# Altium schematic sheet Uart_Can.SchDoc
size A4
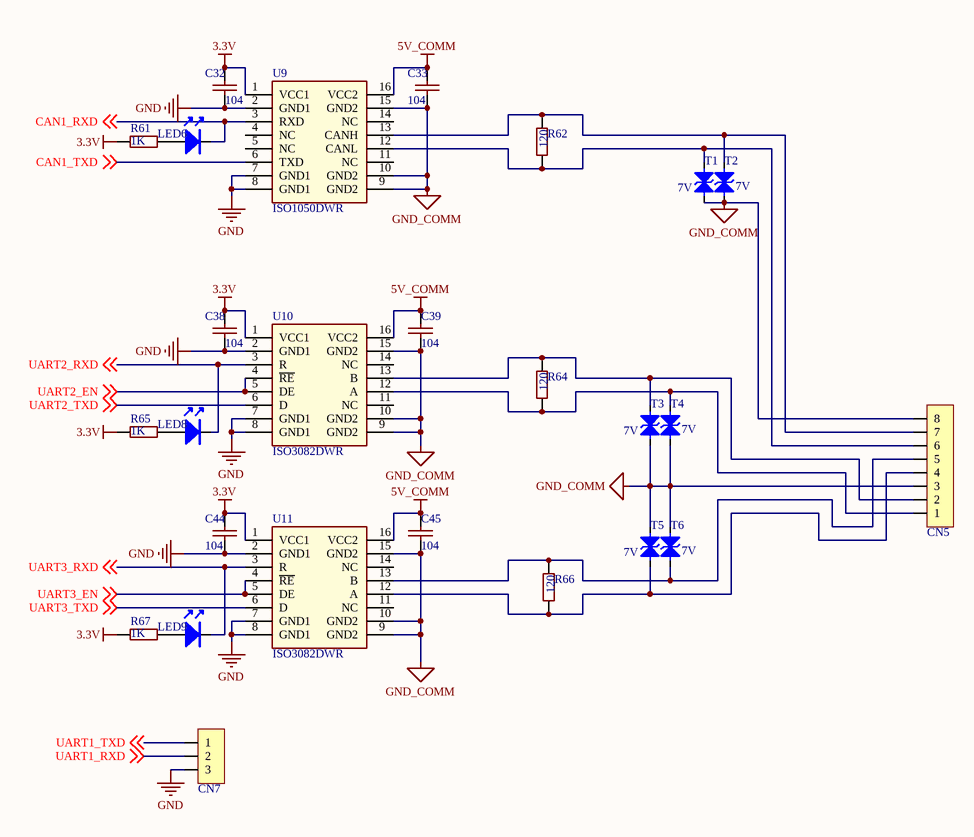
[diagram p0: Uart_Can.SchDoc]

## Parts
C32  104  [0805SMD_Cap]
C33  104  [0805SMD_Cap]
C38  104  [0805SMD_Cap]
C39  104  [0805SMD_Cap]
C44  104  [0805SMD_Cap]
C45  104  [0805SMD_Cap]
CN5  CON8  [WJ15EDGRM-3.81-8P]  (value not drawn)
CN7  CON3  [DIP3]  (value not drawn)
LED6  LED  [发光二极管0805]  (value not drawn)
LED8  LED  [发光二极管0805]  (value not drawn)
LED9  LED  [发光二极管0805]  (value not drawn)
R61  1K  [0805_SMD_R]
R62  120  [0805_SMD_R]
R64  120  [0805_SMD_R]
R65  1K  [0805_SMD_R]
R66  120  [0805_SMD_R]
R67  1K  [0805_SMD_R]
T1  7V  [二极管SMA]
T2  7V  [二极管SMA]
T3  7V  [二极管SMA]
T4  7V  [二极管SMA]
T5  7V  [二极管SMA]
T6  7V  [二极管SMA]
U9  ISO1050DWR  [SOIC_16]
U10  ISO3082DWR  [SOIC_16]
U11  ISO3082DWR  [SOIC_16]

## Nets
3.3V: C32.2 C38.2 C44.2 R61.2 R65.2 R67.2 U9.1(VCC1) U10.1(VCC1) U11.1(VCC1)
5V_COMM: C33.2 C39.2 C45.2 U9.16(VCC2) U10.16(VCC2) U11.16(VCC2)
GND: C32.1 C38.1 C44.1 CN7.3 U9.2(GND1) U9.7(GND1) U9.8(GND1) U10.2(GND1) U10.7(GND1) U10.8(GND1) U11.2(GND1) U11.7(GND1) U11.8(GND1)
GND_COMM: C33.1 C39.1 C45.1 CN5.3 CN5.8 T1.A T2.A T3.A T4.A T5.K T6.K U9.9(GND2) U9.10(GND2) U9.15(GND2) U10.9(GND2) U10.10(GND2) U10.15(GND2) U11.9(GND2) U11.10(GND2) U11.15(GND2)
CAN1_RXD: LED6.K U9.3(RXD) ; off-sheet CAN1_RXD
CAN1_TXD: U9.6(TXD) ; off-sheet CAN1_TXD
UART1_RXD: CN7.2 ; off-sheet UART1_RXD
UART1_TXD: CN7.1 ; off-sheet UART1_TXD
UART2_EN: U10.4(~{RE}) U10.5(DE) ; off-sheet UART2_EN
UART2_RXD: LED8.K U10.3(R) ; off-sheet UART2_RXD
UART2_TXD: U10.6(D) ; off-sheet UART2_TXD
UART3_EN: U11.4(~{RE}) U11.5(DE) ; off-sheet UART3_EN
UART3_RXD: LED9.K U11.3(R) ; off-sheet UART3_RXD
UART3_TXD: U11.6(D) ; off-sheet UART3_TXD
NetCN5_1: CN5.1 R64.1 T4.K U10.12(A)
NetCN5_2: CN5.2 R64.2 T3.K U10.13(B)
NetCN5_4: CN5.4 R66.1 T5.A U11.12(A)
NetCN5_5: CN5.5 R66.2 T6.A U11.13(B)
NetCN5_6: CN5.6 R62.1 T1.K U9.12(CANL)
NetCN5_7: CN5.7 R62.2 T2.K U9.13(CANH)
NetLED6_A: LED6.A R61.1
NetLED8_A: LED8.A R65.1
NetLED9_A: LED9.A R67.1

Not connected (* = marked no-connect by the designer): U9 4(NC) 5(NC) 11(NC) 14(NC); U10 11(NC) 14(NC); U11 11(NC) 14(NC)

## Library data of the parts
C32 C33 C38 C39 C44 C45 = SMD_Cap: 贴片电容; 研究所: 贴装电容_0805_0.1uF; 松下: GR21BB1H104K; 松下: GR21BB1H224K; 松下: GR21BB1H103K; 研究所: 贴装电容_0805_0.22uF; 研究所: 贴装电容_0805_0.01uF; 松下: GR21BB1H473K; 研究所: 贴装电容_0805_0.047uF; 松下: GR21BB1H300K; 研究所: 贴装电容_0805_30pF; 松下: GR21BB1H105K; 研究所: 贴装电容_0805_1uF; 松下: GR21BB1H472K; 研究所: 贴装电容_0805_4700pF
CN5 = CON8: 连接器; 松下: B9PVHB
CN7 = CON3: 连接器; 松下: B3PVHB
LED6 LED8 LED9 = LED: 发光二极管
R61 R62 R64-R67 = SMD_0805: 贴片电阻; 松下: RS05K101FT; 松下: RS05000FT; 松下: RS05K3321FT; 松下: RS05K6811FT; 松下: RS05K102FT; 松下: RS05K2211FT; 松下: RS05K103FT; 松下: RS05K5111FT; 松下: RS05K5110FT; 松下: RS05K5112FT; 松下: RS05K8251FT; 松下: RS05K2212FT; 松下: RS05K104FT; 松下: RS05K5113FT; 松下: RS05K105FT; 松下: RS05L106FT; 研究所: 贴装电阻_0805_0_F1%; 研究所: 贴装电阻_0805_100_F1%; 研究所: 贴装电阻_0805_51.1K_F1%; 研究所: 贴装电阻_0805_1K_F1%; 研究所: 贴装电阻_0805_2.21K_F1%; 研究所: 贴装电阻_0805_3.32K_F1%; 研究所: 贴装电阻_0805_5.11K_F1%; 研究所: 贴装电阻_0805_511K_F1%; 研究所: 贴装电阻_0805_6.81K_F1%; 研究所: 贴装电阻_0805_511_F1%; 研究所: 贴装电阻_0805_8.25K_F1%; 研究所: 贴装电阻_0805_10K_F1%; 研究所: 贴装电阻_0805_22.1K_F1%; 研究所: 贴装电阻_0805_100K_F1%; 研究所: 贴装电阻_0805_1M_F1%; 研究所: 贴装电阻_0805_10M_F1%
T1-T6 = 双向TVS_?V(SMA): 名称: 贴装元件_双向TVS_7V(SMA)
U9 = ISO1050DWR: CAN隔离芯片
U10 U11 = ISO3082DWR: 485隔离芯片